# Altium schematic sheet LED_B.SchDoc
size B; SheetNumber: 1; SheetTotal: 3
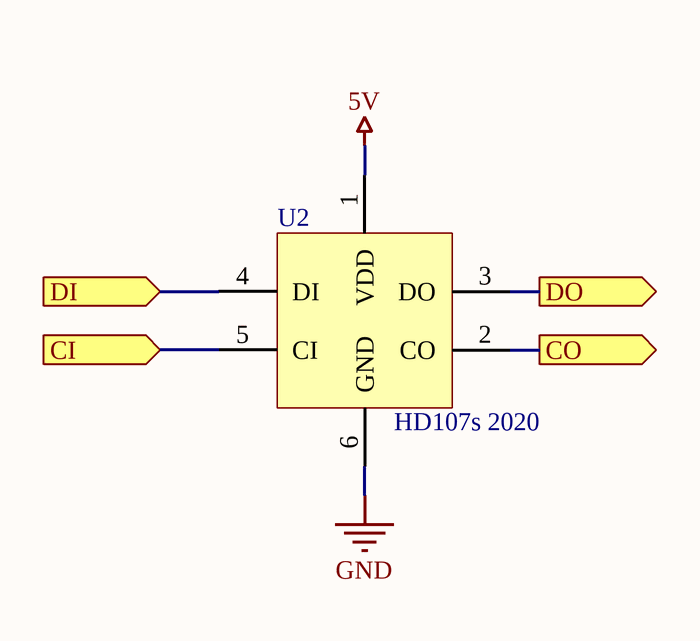
[diagram p0: LED_B.SchDoc]

## Parts
U2  HD107s 2020  [LED_HD107s-2020]

## Ports
CI (in), CO (out), DI (in), DO (out)

## Nets
5V: U2.1(VDD)
GND: U2.6(GND)
CI: U2.5(CI) ; port CI
CO: U2.2(CO) ; port CO
DI: U2.4(DI) ; port DI
DO: U2.3(DO) ; port DO

## Library data of the parts
U2 = HD107s-2020: 8-pin type LED three-color RGB Dimming control; MP: APA-102-2020-256-8; MF: iPixel LED Light Co.; Value: *; SnapEDA_Link: https://www.snapeda.com/parts/APA-102-2020-256-8/iPixel%20LED%20Light%20Co./view-part/698331/?ref=snap; Availability: Unavailable; Package: SMD-8 iPixel LED Light Co.; Price: None